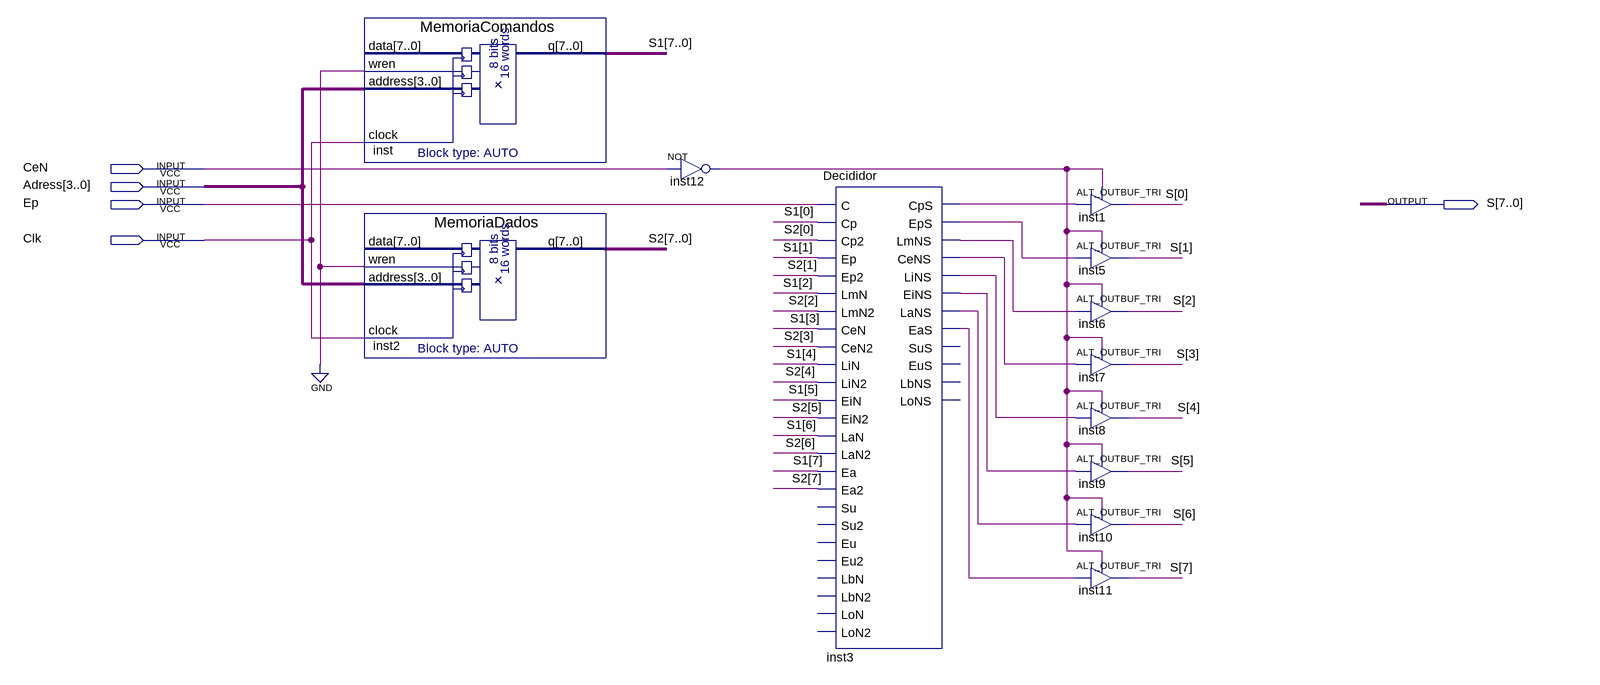
[diagram p0: schematic sheet]
// Quartus schematic Memoria-RAM.bdf as structural Verilog: 12 symbols, 5 pins
module \Memoria-RAM  (
  input  CeN,
  input  [3:0] Adress,
  input  Ep,
  input  Clk,
  output [7:0] S
);

  wire inst3_cens, inst3_cps, inst3_eas, inst3_eins, inst3_eps, inst3_lans, inst3_lins, inst3_lmns,
       inst12_out;
  wire [7:0] S1, S2;

  MemoriaComandos inst (.wren(1'b0), .address(Adress), .clock(Clk), .q(S1));  // open: data
  MemoriaDados inst2 (.wren(1'b0), .address(Adress), .clock(Clk), .q(S2));  // open: data
  not inst12 (inst12_out, CeN);
  Decididor inst3 (
    .C(Ep), .Cp(S1[0]), .Cp2(S2[0]), .Ep(S1[1]), .Ep2(S2[1]), .LmN(S1[2]), .LmN2(S2[2]), .CeN(S1[3]),
    .CeN2(S2[3]), .LiN(S1[4]), .LiN2(S2[4]), .EiN(S1[5]), .EiN2(S2[5]), .LaN(S1[6]), .LaN2(S2[6]),
    .Ea(S1[7]), .Ea2(S2[7]), .CpS(inst3_cps), .EpS(inst3_eps), .LmNS(inst3_lmns), .CeNS(inst3_cens),
    .LiNS(inst3_lins), .EiNS(inst3_eins), .LaNS(inst3_lans), .EaS(inst3_eas));  // open: Su, Su2, Eu, Eu2, LbN, LbN2, LoN, LoN2, SuS, EuS, LbNS, LoNS
  ALT_OUTBUF_TRI inst1 (.i(inst3_cps), .oe(inst12_out), .o(S[0]));
  ALT_OUTBUF_TRI inst5 (.i(inst3_eps), .oe(inst12_out), .o(S[1]));
  ALT_OUTBUF_TRI inst6 (.i(inst3_lmns), .oe(inst12_out), .o(S[2]));
  ALT_OUTBUF_TRI inst7 (.i(inst3_cens), .oe(inst12_out), .o(S[3]));
  ALT_OUTBUF_TRI inst8 (.i(inst3_lins), .oe(inst12_out), .o(S[4]));
  ALT_OUTBUF_TRI inst9 (.i(inst3_eins), .oe(inst12_out), .o(S[5]));
  ALT_OUTBUF_TRI inst10 (.i(inst3_lans), .oe(inst12_out), .o(S[6]));
  ALT_OUTBUF_TRI inst11 (.i(inst3_eas), .oe(inst12_out), .o(S[7]));
endmodule
